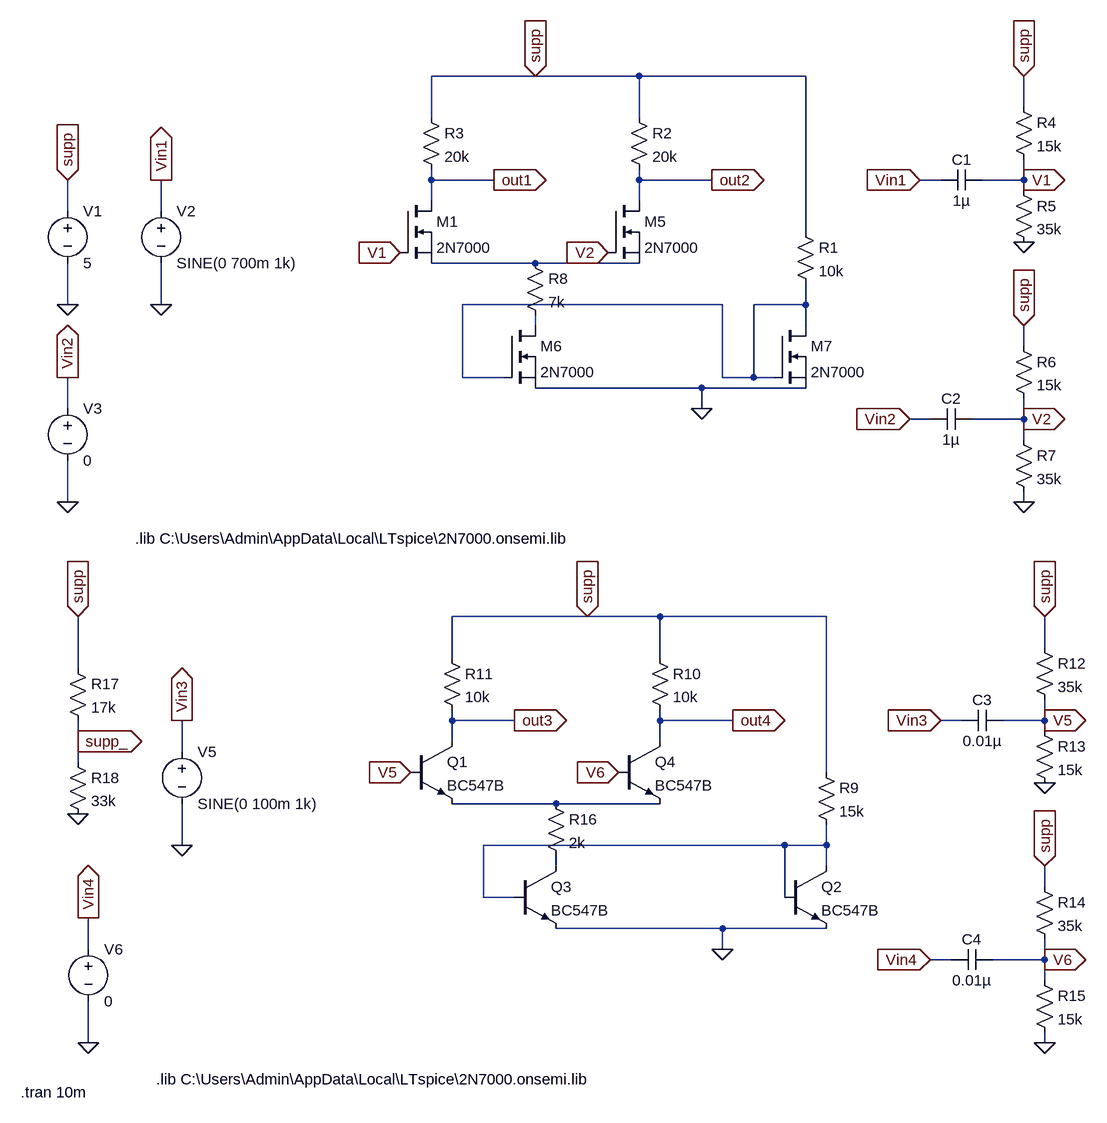
[diagram p0: schematic EW2_project1_amp_stage_3.asc]
EW2_project1_amp_stage_3.asc, the LTspice schematic file:
Version 4
SHEET 1 988 1880
WIRE 64 64 -96 64
WIRE 224 64 64 64
WIRE 480 64 224 64
WIRE 816 112 816 64
WIRE -96 128 -96 64
WIRE 224 128 224 64
WIRE -96 224 -96 208
WIRE 0 224 -96 224
WIRE 224 224 224 208
WIRE 336 224 224 224
WIRE 688 224 656 224
WIRE 816 224 816 192
WIRE 816 224 752 224
WIRE 816 240 816 224
WIRE -96 256 -96 224
WIRE 224 256 224 224
WIRE -656 272 -656 224
WIRE -512 272 -512 224
WIRE 480 304 480 64
WIRE 64 352 -96 352
WIRE 224 352 64 352
WIRE -656 416 -656 352
WIRE -512 416 -512 352
WIRE 352 416 -48 416
WIRE 480 416 480 384
WIRE 480 416 400 416
WIRE 64 448 64 432
WIRE 480 448 480 416
WIRE 816 480 816 448
WIRE -48 528 -48 416
WIRE 16 528 -48 528
WIRE 352 528 352 416
WIRE 400 528 400 416
WIRE 400 528 352 528
WIRE 432 528 400 528
WIRE 320 544 64 544
WIRE 480 544 320 544
WIRE -656 576 -656 528
WIRE 320 576 320 544
WIRE 672 592 640 592
WIRE 816 592 816 560
WIRE 816 592 736 592
WIRE 816 624 816 592
WIRE -656 720 -656 656
WIRE 816 720 816 704
WIRE 144 896 -64 896
WIRE 256 896 144 896
WIRE 512 896 256 896
WIRE 848 944 848 896
WIRE -64 960 -64 896
WIRE 256 960 256 896
WIRE -640 976 -640 896
WIRE -64 1056 -64 1040
WIRE 32 1056 -64 1056
WIRE 256 1056 256 1040
WIRE 368 1056 256 1056
WIRE 720 1056 688 1056
WIRE 848 1056 848 1024
WIRE 848 1056 784 1056
WIRE 848 1072 848 1056
WIRE -640 1088 -640 1056
WIRE -64 1088 -64 1056
WIRE 256 1088 256 1056
WIRE -480 1104 -480 1056
WIRE -640 1120 -640 1088
WIRE 512 1136 512 896
WIRE 96 1184 -64 1184
WIRE 256 1184 96 1184
WIRE -480 1248 -480 1184
WIRE 448 1248 -16 1248
WIRE 512 1248 512 1216
WIRE 512 1248 448 1248
WIRE 96 1280 96 1264
WIRE 512 1280 512 1248
WIRE 848 1312 848 1280
WIRE -16 1328 -16 1248
WIRE 32 1328 -16 1328
WIRE 448 1328 448 1248
WIRE 352 1376 96 1376
WIRE 512 1376 352 1376
WIRE -624 1408 -624 1360
WIRE 352 1408 352 1376
WIRE 704 1424 672 1424
WIRE 848 1424 848 1392
WIRE 848 1424 768 1424
WIRE 848 1456 848 1424
WIRE -624 1552 -624 1488
WIRE 848 1552 848 1536
FLAG -656 224 supp
IOPIN -656 224 In
FLAG 64 64 supp
IOPIN 64 64 In
FLAG -512 416 0
FLAG -656 416 0
FLAG -656 720 0
FLAG 816 320 0
FLAG 816 64 supp
IOPIN 816 64 In
FLAG 656 224 Vin1
IOPIN 656 224 In
FLAG 640 592 Vin2
IOPIN 640 592 In
FLAG 816 448 supp
IOPIN 816 448 In
FLAG 816 720 0
FLAG 0 224 out1
IOPIN 0 224 Out
FLAG 336 224 out2
IOPIN 336 224 Out
FLAG -144 336 V1
IOPIN -144 336 In
FLAG 176 336 V2
IOPIN 176 336 In
FLAG 816 224 V1
IOPIN 816 224 Out
FLAG 816 592 V2
IOPIN 816 592 Out
FLAG -512 224 Vin1
IOPIN -512 224 Out
FLAG -656 528 Vin2
IOPIN -656 528 Out
FLAG 320 576 0
FLAG -640 896 supp
IOPIN -640 896 In
FLAG -480 1248 0
FLAG -624 1552 0
FLAG 848 1152 0
FLAG 848 896 supp
IOPIN 848 896 In
FLAG 688 1056 Vin3
IOPIN 688 1056 In
FLAG 672 1424 Vin4
IOPIN 672 1424 In
FLAG 848 1280 supp
IOPIN 848 1280 In
FLAG 848 1552 0
FLAG 32 1056 out3
IOPIN 32 1056 Out
FLAG 368 1056 out4
IOPIN 368 1056 Out
FLAG -128 1136 V5
IOPIN -128 1136 In
FLAG 192 1136 V6
IOPIN 192 1136 In
FLAG 848 1056 V5
IOPIN 848 1056 Out
FLAG 848 1424 V6
IOPIN 848 1424 Out
FLAG -480 1056 Vin3
IOPIN -480 1056 Out
FLAG -624 1360 Vin4
IOPIN -624 1360 Out
FLAG 352 1408 0
FLAG -640 1200 0
FLAG -640 1088 supp_
IOPIN -640 1088 Out
FLAG 144 896 supp
IOPIN 144 896 In
SYMBOL res 464 288 R0
SYMATTR InstName R1
SYMATTR Value 10k
SYMBOL res 208 112 R0
SYMATTR InstName R2
SYMATTR Value 20k
SYMBOL res -112 112 R0
SYMATTR InstName R3
SYMATTR Value 20k
SYMBOL voltage -656 256 R0
WINDOW 123 0 0 Left 0
WINDOW 39 0 0 Left 0
SYMATTR InstName V1
SYMATTR Value 5
SYMBOL voltage -512 256 R0
WINDOW 123 0 0 Left 0
WINDOW 39 0 0 Left 0
SYMATTR InstName V2
SYMATTR Value SINE(0 700m 1k)
SYMBOL voltage -656 560 R0
WINDOW 123 0 0 Left 0
WINDOW 39 0 0 Left 0
SYMATTR InstName V3
SYMATTR Value 0
SYMBOL res 800 96 R0
SYMATTR InstName R4
SYMATTR Value 15k
SYMBOL res 800 224 R0
SYMATTR InstName R5
SYMATTR Value 35k
SYMBOL cap 752 208 R90
WINDOW 0 0 32 VBottom 2
WINDOW 3 32 32 VTop 2
SYMATTR InstName C1
SYMATTR Value 1µ
SYMBOL res 800 464 R0
SYMATTR InstName R6
SYMATTR Value 15k
SYMBOL res 800 608 R0
SYMATTR InstName R7
SYMATTR Value 35k
SYMBOL cap 736 576 R90
WINDOW 0 0 32 VBottom 2
WINDOW 3 32 32 VTop 2
SYMATTR InstName C2
SYMATTR Value 1µ
SYMBOL nmos -144 256 R0
SYMATTR InstName M1
SYMATTR Value 2N7000
SYMATTR Prefix X
SYMBOL nmos 176 256 R0
SYMATTR InstName M5
SYMATTR Value 2N7000
SYMATTR Prefix X
SYMBOL nmos 16 448 R0
SYMATTR InstName M6
SYMATTR Value 2N7000
SYMATTR Prefix X
SYMBOL nmos 432 448 R0
SYMATTR InstName M7
SYMATTR Value 2N7000
SYMATTR Prefix X
SYMBOL res 48 336 R0
SYMATTR InstName R8
SYMATTR Value 7k
SYMBOL res 496 1120 R0
SYMATTR InstName R9
SYMATTR Value 15k
SYMBOL res 240 944 R0
SYMATTR InstName R10
SYMATTR Value 10k
SYMBOL res -80 944 R0
SYMATTR InstName R11
SYMATTR Value 10k
SYMBOL voltage -480 1088 R0
WINDOW 123 0 0 Left 0
WINDOW 39 0 0 Left 0
SYMATTR InstName V5
SYMATTR Value SINE(0 100m 1k)
SYMBOL voltage -624 1392 R0
WINDOW 123 0 0 Left 0
WINDOW 39 0 0 Left 0
SYMATTR InstName V6
SYMATTR Value 0
SYMBOL res 832 928 R0
SYMATTR InstName R12
SYMATTR Value 35k
SYMBOL res 832 1056 R0
SYMATTR InstName R13
SYMATTR Value 15k
SYMBOL cap 784 1040 R90
WINDOW 0 0 32 VBottom 2
WINDOW 3 32 32 VTop 2
SYMATTR InstName C3
SYMATTR Value 0.01µ
SYMBOL res 832 1296 R0
SYMATTR InstName R14
SYMATTR Value 35k
SYMBOL res 832 1440 R0
SYMATTR InstName R15
SYMATTR Value 15k
SYMBOL cap 768 1408 R90
WINDOW 0 0 32 VBottom 2
WINDOW 3 32 32 VTop 2
SYMATTR InstName C4
SYMATTR Value 0.01µ
SYMBOL res 80 1168 R0
SYMATTR InstName R16
SYMATTR Value 2k
SYMBOL npn -128 1088 R0
SYMATTR InstName Q1
SYMATTR Value BC547B
SYMBOL npn 448 1280 R0
SYMATTR InstName Q2
SYMATTR Value BC547B
SYMBOL npn 32 1280 R0
SYMATTR InstName Q3
SYMATTR Value BC547B
SYMBOL npn 192 1088 R0
SYMATTR InstName Q4
SYMATTR Value BC547B
SYMBOL res -656 960 R0
SYMATTR InstName R17
SYMATTR Value 17k
SYMBOL res -656 1104 R0
SYMATTR InstName R18
SYMATTR Value 33k
TEXT -552 776 Left 2 !.lib C:\\Users\\Admin\\AppData\\Local\\LTspice\\2N7000.onsemi.lib
TEXT -520 1608 Left 2 !.lib C:\\Users\\Admin\\AppData\\Local\\LTspice\\2N7000.onsemi.lib
TEXT -728 1628 Left 2 !.tran 10m

The netlist it stands for:
* EW2_project1_amp_stage_3.asc
R1 supp N002 10k
R2 supp out2 20k
R3 supp out1 20k
V1 supp 0 5
V2 Vin1 0 SINE(0 700m 1k)
V3 Vin2 0 0
R4 supp V1 15k
R5 V1 0 35k
C1 V1 Vin1 1µ
R6 supp V2 15k
R7 V2 0 35k
C2 V2 Vin2 1µ
XM1 out1 V1 N001 2N7000  ; pins D G S
XM5 out2 V2 N001 2N7000  ; pins D G S
XM6 N003 N002 0 2N7000  ; pins D G S
XM7 N002 N002 0 2N7000  ; pins D G S
R8 N001 N003 7k
R9 supp N005 15k
R10 supp out4 10k
R11 supp out3 10k
V5 Vin3 0 SINE(0 100m 1k)
V6 Vin4 0 0
R12 supp V5 35k
R13 V5 0 15k
C3 V5 Vin3 0.01µ
R14 supp V6 35k
R15 V6 0 15k
C4 V6 Vin4 0.01µ
R16 N004 N006 2k
Q1 out3 V5 N004 0 BC547B
Q2 N005 N005 0 0 BC547B
Q3 N006 N005 0 0 BC547B
Q4 out4 V6 N004 0 BC547B
R17 supp supp_ 17k
R18 supp_ 0 33k
.model NPN NPN
.model PNP PNP
.lib standard.bjt
.lib C:\Users\Admin\AppData\Local\LTspice\2N7000.onsemi.lib
.lib C:\Users\Admin\AppData\Local\LTspice\2N7000.onsemi.lib
.tran 10m
.backanno
.end